# EAGLE design dashboard - Copy (EAGLE 7.6.0)
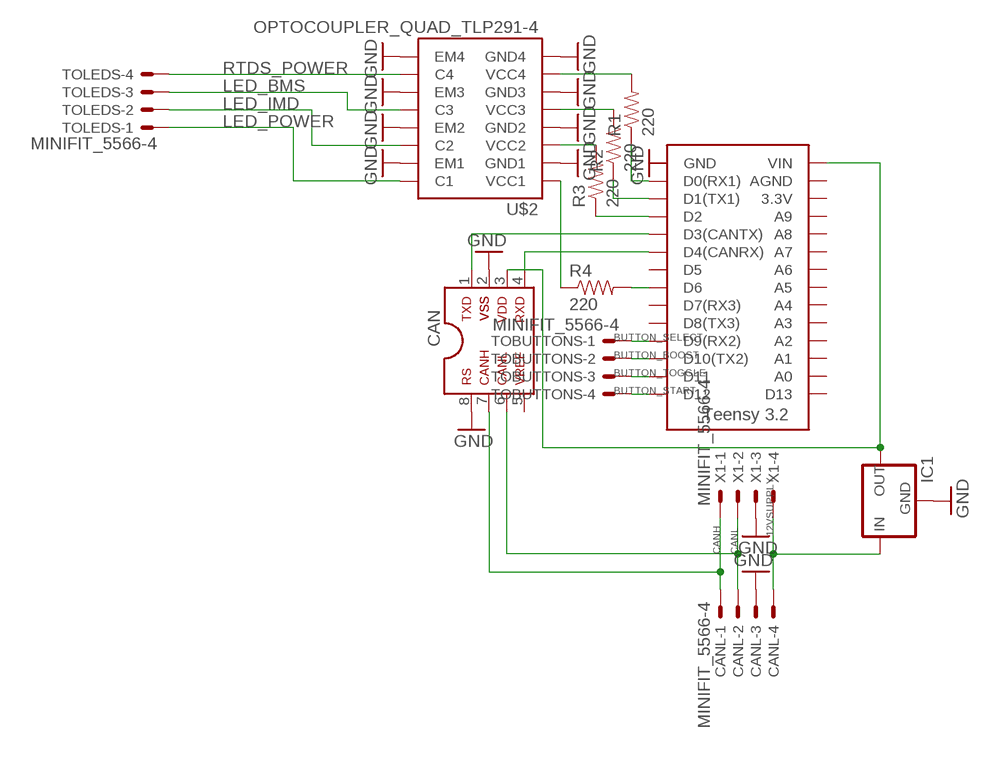
[diagram p0: schematic, sheet 1]

## Parts
CAN  MCP2551SOIC  [SOIC08]
CANL  MINIFIT_5566-4  [MINIFIT_5566-4]
IC1  5V_REGULATOR_LM340-NLM340MPX-5.0/NOPB  [SOT223]
R1  220  RESISTOR0805-RES  [0805]
R2  220  RESISTOR0805-RES  [0805]
R3  220  RESISTOR0805-RES  [0805]
R4  220  RESISTOR0805-RES  [0805]
TOBUTTONS  MINIFIT_5566-4  [MINIFIT_5566-4]
TOLEDS  MINIFIT_5566-4  [MINIFIT_5566-4]
U$1  TEENSY_3.2_SIMPLE  [TEENSY_3.2_SIMPLE]
U$2  OPTOCOUPLER_QUAD_TLP291-4  [SO-16]
X1  MINIFIT_5566-4  [MINIFIT_5566-4]

## Nets
12VSUPPLY: CANL.4 IC1.1(IN) X1.4
BUTTON_BOOST: TOBUTTONS.2 U$1.D10(TX2)
BUTTON_SELECT: TOBUTTONS.1 U$1.D9(RX2)
BUTTON_START: TOBUTTONS.4 U$1.D12
BUTTON_TOGGLE: TOBUTTONS.3 U$1.D11
CANH: CAN.7 CANL.1 X1.1
CANL: CAN.6 CANL.2 X1.2
GND: CAN.2 CAN.8 CANL.3 IC1.2(GND) IC1.4(GND) U$2.2(GND1) U$2.4(GND2) U$2.6(GND3) U$2.8(GND4) U$2.9(EM4) U$2.11(EM3) U$2.13(EM2) U$2.15(EM1) X1.3
LED_BMS: TOLEDS.3 U$2.12(C3)
LED_IMD: TOLEDS.2 U$2.14(C2)
LED_POWER: TOLEDS.1 U$2.16(C1)
N$1: R1.1 U$1.D0(RX1)
N$2: CAN.1 U$1.D3(CANTX)
N$3: CAN.4 U$1.D4(CANRX)
N$4: R2.1 U$1.D1(TX1)
N$5: R3.1 U$1.D2
N$8: R4.1 U$2.1(VCC1)
N$9: R4.2 U$1.D6
N$15: R1.2 U$2.7(VCC4)
N$16: R2.2 U$2.5(VCC3)
N$17: R3.2 U$2.3(VCC2)
N$19: CAN.3 IC1.3(OUT) U$1.VIN
RTDS_POWER: TOLEDS.4 U$2.10(C4)
Unconnected: CAN.5 U$1.3.3V U$1.A0 U$1.A1 U$1.A2 U$1.A3 U$1.A4 U$1.A5 U$1.A6 U$1.A7 U$1.A8 U$1.A9 U$1.AGND U$1.D5 U$1.D7(RX3) U$1.D8(TX3) U$1.D13 U$1.GND

## Library data of the parts
CAN = HyTechDevices:MCP2551: MCP2551 High-Speed CAN Transceiver Product Webpage <https://www.microchip.com/wwwproducts/en/MCP2551> Datasheet <http://ww1.microchip.com/downloads/en/DeviceDoc/21667f.pdf> This device is outdated It is replaced by MCP2561. Comparison Page <https://www.microchip.com/wwwproducts/ProductCompare/MCP2551/MCP2561> Product Webpage <https://www.microchip.com/wwwproducts/en/MCP2561> Datasheet <http://ww1.microchip.com/downloads/en/DeviceDoc/20005167C.pdf>
CANL TOBUTTONS TOLEDS X1 = HyTechDevices:MINIFIT_5566-4: Mini FIT Junior connector 4 pole Source: http://www.molex.com; OC_FARNELL: unknown; OC_NEWARK: unknown
IC1 = HyTechDevices:5V_REGULATOR_LM340-N: Voltage Regulator 5v linear voltage regulator Datasheet <http://www.mouser.com/ProductDetail/Texas-Instruments/LM340MPX-50-NOPB/?qs=X1J7HmVL2ZGZwtTFRQ9ItA%3D%3D> MAX current out: 1.5A MAX voltage in: 35V
R1-R4 = HyTechDevices:RESISTOR: Resistor Basic schematic elements and footprints for 0603, 1206, and PTH resistors.
U$1 = HyTechDevices:TEENSY_3.2_SIMPLE: Simple version of the Teensy 3.2 board that only uses the 2 main rows of pins, not the inner pins or the pins opposite the usb port.
U$2 = HyTechDevices:OPTOCOUPLER_QUAD_TLP291-4

## Board
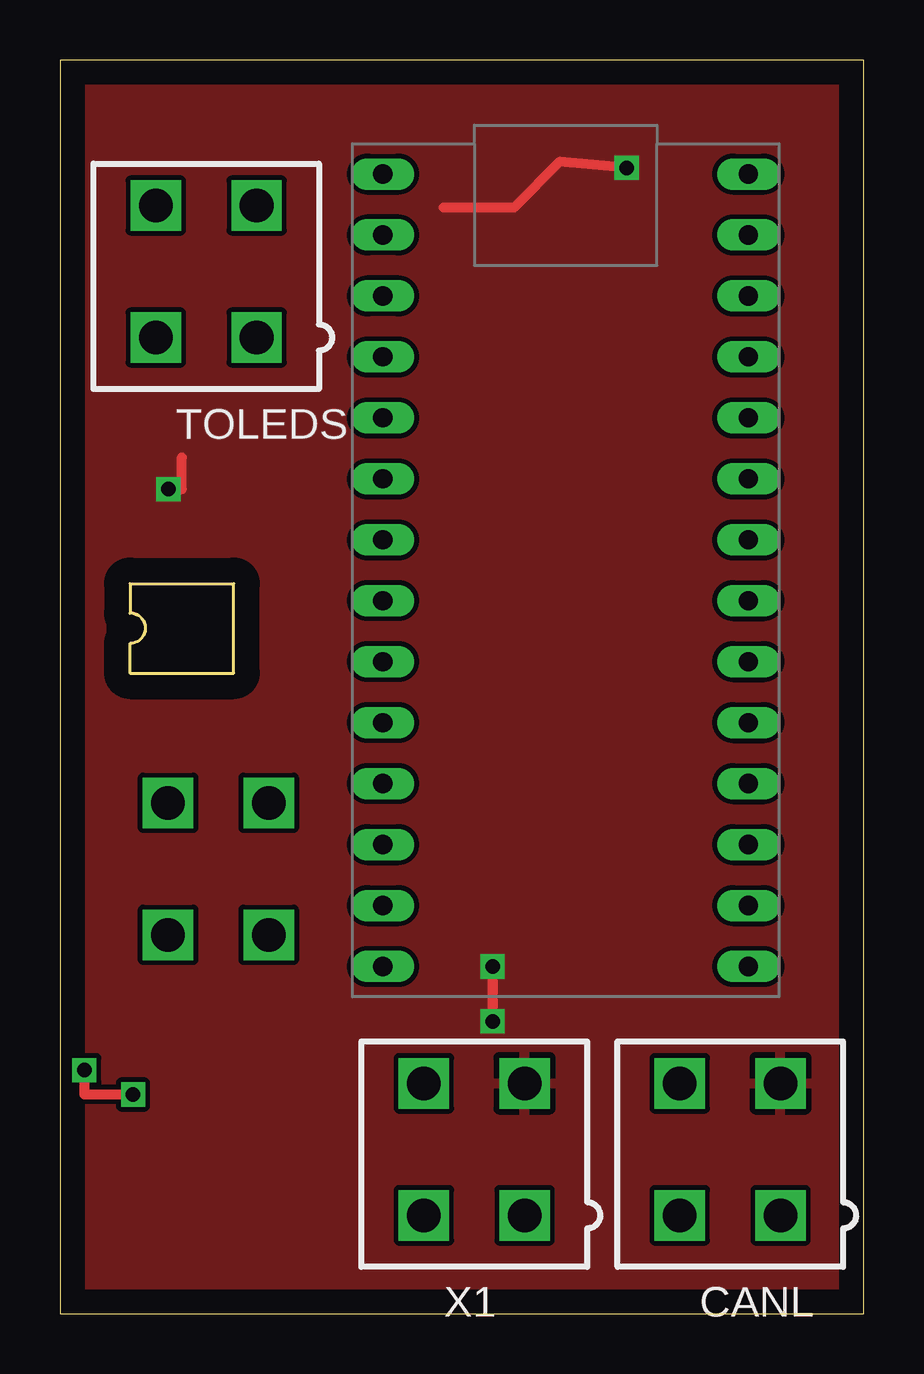
[diagram p1: board, top side]
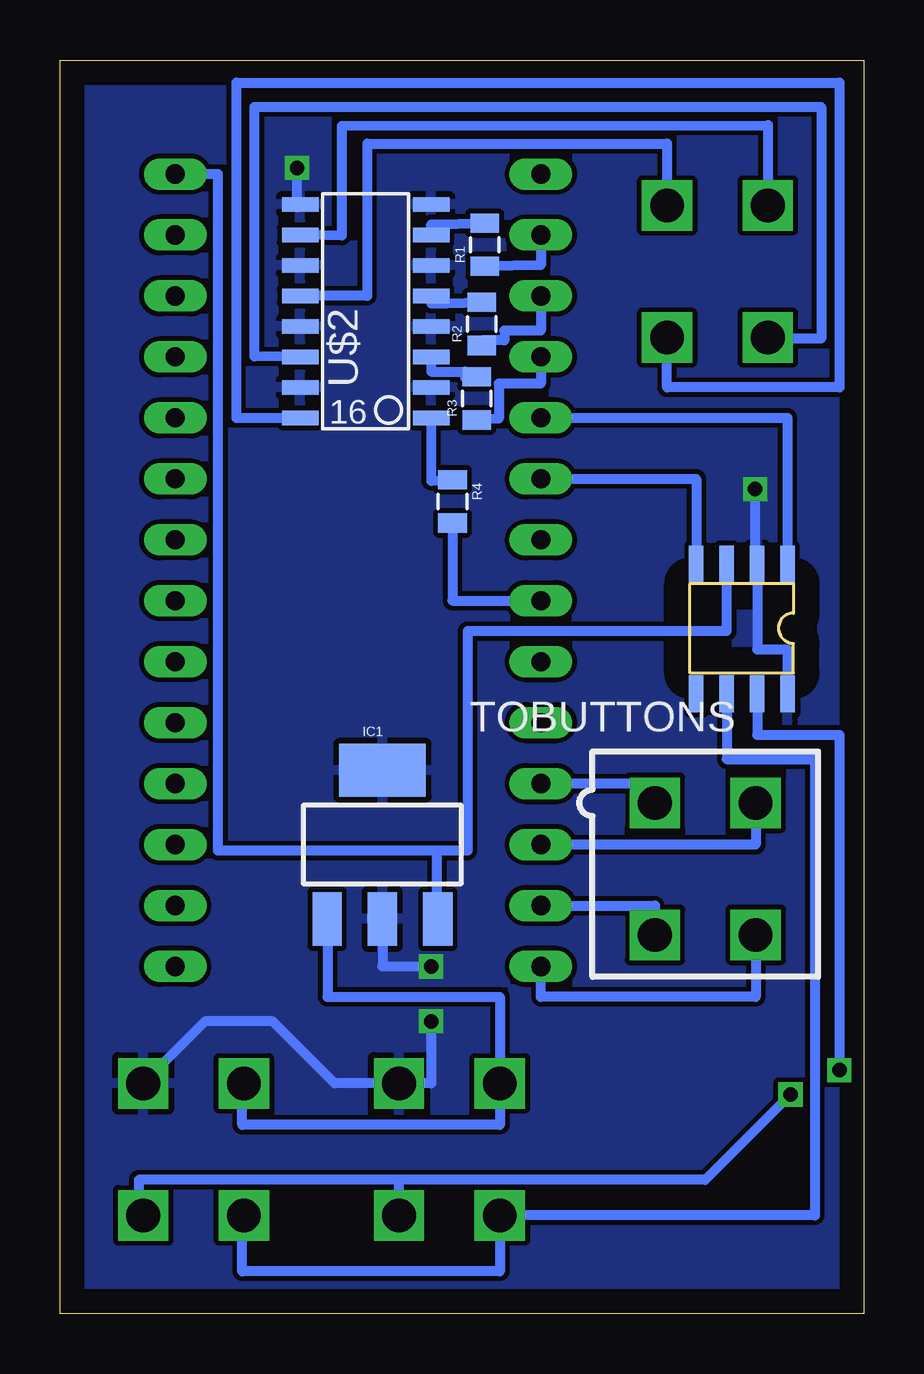
[diagram p2: board, bottom side, seen from below]

Size 33.51 x 52.25 mm. Coordinates in mm from the lower left corner, seen from the top.
Outline: 0,0 33.51,0 33.51,52.25 0,52.25 0,0
Copper layers (1*16): Top 0.035mm / dielectric 1.5mm / Bottom 0.035mm
Design rules "default": minimum track width 10mil, minimum drill 24mil, track to track 8mil, track to pad 8mil, pad to pad 8mil, via to via 8mil, smd to smd 8mil, copper to edge 40mil, drill to drill 8mil, minimum pad ring 10mil, minimum via ring 8mil, stop-mask expansion 4mil, vias tented up to drill 0mil, thermal gap 10mil

### Footprints (pad centres in the part's own frame; a part is rotated, then mirrored left to right if it is on the bottom)
SOIC08 = smd 0.6 x 1.55: 1 0,0; 2 1.27,0; 3 2.54,0; 4 3.81,0; 5 3.81,5.4; 6 2.54,5.4; 7 1.27,5.4; 8 0,5.4
MINIFIT_5566-4 = drill 1.4 square: 1 2.1,-2.75; 2 -2.1,-2.75; 3 2.1,2.75; 4 -2.1,2.75
SOT223 = smd 1.219 x 2.235: 1 -2.311,-3.099; 2 0,-3.099; 3 2.311,-3.099 | smd 3.6 x 2.2: 4 0,3.099
0805 = smd 0.8 x 1.2: 1 -0.9,0; 2 0.9,0
TEENSY_3.2_SIMPLE = drill 0.8 long: 3.3V 16.51,29.21; A0 16.51,3.81; A1 16.51,6.35; A2 16.51,8.89; A3 16.51,11.43; A4 16.51,13.97; A5 16.51,16.51; A6 16.51,19.05; A7 16.51,21.59; A8 16.51,24.13; A9 16.51,26.67; AGND 16.51,31.75; D0(RX1) 1.27,31.75; D1(TX1) 1.27,29.21; D2 1.27,26.67; D3(CANTX) 1.27,24.13; D4(CANRX) 1.27,21.59; D5 1.27,19.05; D6 1.27,16.51; D7(RX3) 1.27,13.97; D8(TX3) 1.27,11.43; D9(RX2) 1.27,8.89; D10(TX2) 1.27,6.35; D11 1.27,3.81; D12 1.27,1.27; D13 16.51,1.27; GND 1.27,34.29; VIN 16.51,34.29
SO-16 = smd 0.61 x 1.524: 1 -4.445,-2.794; 2 -3.175,-2.794; 3 -1.905,-2.794; 4 -0.635,-2.794; 5 0.635,-2.794; 6 1.905,-2.794; 7 3.175,-2.794; 8 4.445,-2.794; 9 4.445,2.667; 10 3.175,2.667; 11 1.905,2.667; 12 0.635,2.667; 13 -0.635,2.667; 14 -1.905,2.667; 15 -3.175,2.667; 16 -4.445,2.667

### Placement (x,y rotation side)
CAN  3.18,31.24 180 bottom
CANL  27.94,6.86 0 top
IC1  20.07,19.56 0 bottom
R1  100  [0805]  15.8,44.55 90 bottom
R2  100  [0805]  15.93,41.25 90 bottom
R3  100  [0805]  16.13,38.15 90 bottom
R4  100  [0805]  17.15,33.86 270 bottom
TOBUTTONS  6.6,18.54 180 bottom
TOLEDS  6.1,43.43 0 top
U$1  12.19,13.21 0 top
U$2  20.83,41.78 90 bottom
X1  17.27,6.86 0 top

### Tracks (layer width: path | path; a pad name or v marks a point on that pad's centre or on a via)
12VSUPPLY
  Bottom 0.406: CANL.4 25.91,9.61 25.91,7.87 15.17,7.87 X1.4 15.17,13.21 22.35,13.21 22.35,16.46 IC1.1
BUTTON_BOOST
  Bottom 0.406: TOBUTTONS.2 4.5,19.56 U$1.D10(TX2)
BUTTON_SELECT
  Bottom 0.406: TOBUTTONS.1 8.7,22.1 U$1.D9(RX2)
BUTTON_START
  Bottom 0.406: TOBUTTONS.4 4.5,13.21 13.46,13.21 U$1.D12
BUTTON_TOGGLE
  Bottom 0.406: U$1.D11 8.7,17.02 TOBUTTONS.3
CANH  (via drill 0.6)
  Top 0.406: v1.02,10.16 1.02,9.14 v3.05,9.14
  Bottom 0.406: X1.1 19.37,5.59 | 19.37,5.59 30.23,5.59 30.23,4.11 CANL.1 | v3.05,9.14 6.6,5.59 19.37,5.59 | CAN.7 4.45,24.13 1.02,24.13 v1.02,10.16
CANL
  Bottom 0.406: CANL.2 25.91,4.11 25.91,1.78 15.17,1.78 X1.2 2.03,4.11 2.03,23.11 5.72,23.11 CAN.6
GND  (via drill 0.6)
  Top 0.406: v18.03,14.48 v18.03,12.19 | v23.62,47.75 20.83,48.01 18.92,46.1 16,46.1 | v4.52,34.37 5.08,34.37 5.08,35.69
  Bottom 0.406: CANL.3 27.46,12.19 24.64,12.19 22.05,9.61 X1.3 18.03,9.61 v18.03,12.19 | IC1.2 20.07,14.48 v18.03,14.48 | CAN.8 3.18,27.69 4.45,27.69 CAN.2 4.52,31.24 v4.52,34.37 | U$2.9 23.62,46.1 v23.62,47.75
  pour Bottom: -0.51,52.58 34.04,52.58 33.78,-0.25 -0.51,-0.25
  pour Top: 0,52.32 33.53,52.32 33.53,0 0,0
LED_BMS
  Bottom 0.406: TOLEDS.3 8.2,48.77 20.7,48.77 20.7,42.42 U$2.12
LED_IMD
  Bottom 0.406: U$2.14 25.4,39.9 25.4,50.29 1.78,50.29 1.78,40.64 4,40.64 TOLEDS.2
LED_POWER
  Bottom 0.406: TOLEDS.1 8.2,38.61 1.02,38.61 1.02,51.31 26.16,51.31 26.16,37.34 U$2.16
N$1
  Bottom 0.406: U$1.D0(RX1) 13.46,43.7 R1.1
N$2
  Bottom 0.406: U$1.D3(CANTX) 3.18,37.34 CAN.1
N$3
  Bottom 0.406: U$1.D4(CANRX) 6.98,34.8 CAN.4
N$4
  Bottom 0.406: U$1.D1(TX1) 13.46,40.97 14.99,40.97 14.99,40.56 15.93,40.56 R2.1
N$5
  Bottom 0.406: U$1.D2 13.46,38.76 15.22,38.76 15.22,37.3 R3.1
N$8
  Bottom 0.406: U$2.1 18.03,34.71 R4.1
N$9
  Bottom 0.406: R4.2 17.15,29.72 U$1.D6
N$15
  Bottom 0.406: U$2.7 18.03,45.4 R1.2
N$16
  Bottom 0.406: U$2.5 18.03,42.1 R2.2
N$17
  Bottom 0.406: U$2.3 18.03,39.27 16.61,39.27 16.61,39 R3.2
N$19
  Bottom 0.406: IC1.3 17.78,16.46 17.78,19.3 | 17.78,19.3 26.92,19.3 26.92,47.5 U$1.VIN | 17.78,19.3 16.51,19.3 16.51,28.45 5.72,28.45 CAN.3
RTDS_POWER
  Bottom 0.406: TOLEDS.4 4,49.53 21.77,49.51 21.77,44.93 U$2.10